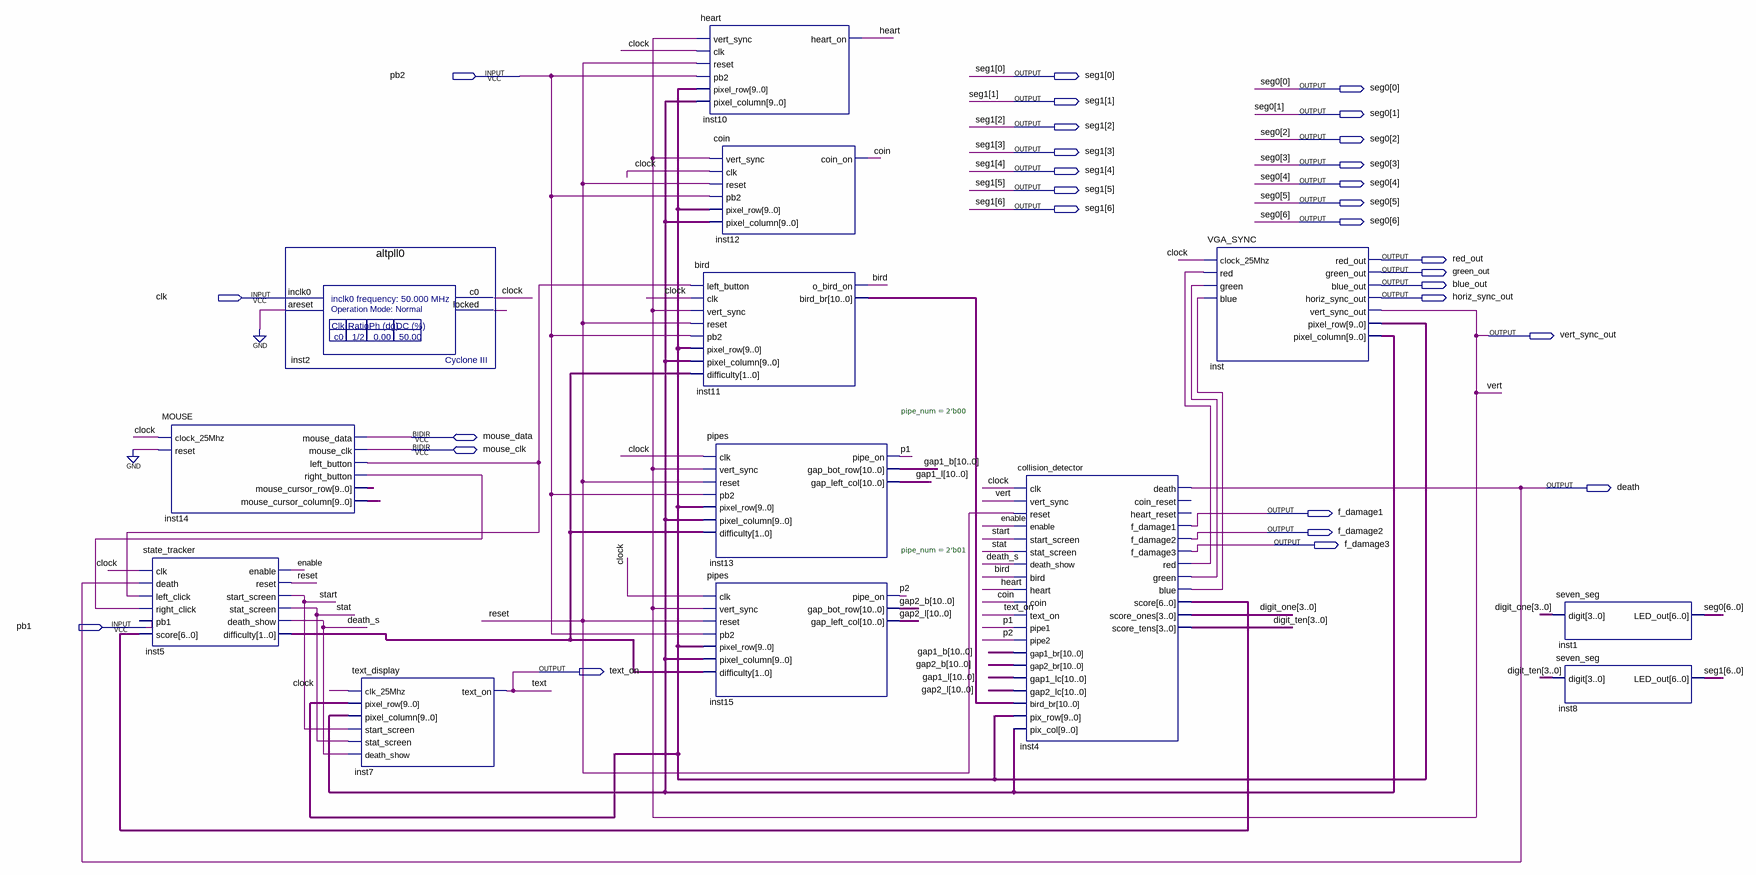
[diagram p0: schematic sheet]
// Quartus schematic GameDesign.bdf as structural Verilog: 13 symbols, 29 pins
module GameDesign (
  input  pb2,
  input  clk,
  input  pb1,
  inout  mouse_data,
  inout  mouse_clk,
  output [6:0] seg1,
  output [6:0] seg0,
  output red_out,
  output green_out,
  output blue_out,
  output horiz_sync_out,
  output vert_sync_out,
  output death,
  output f_damage1,
  output f_damage2,
  output f_damage3,
  output text_on
);

  wire bird, clock, coin, death_s, enable, heart, inst2_locked, inst4_blue, inst4_green, inst4_red,
       inst14_left_button, inst14_right_button, p1, p2, reset, start, stat;
  wire [1:0] inst5_difficulty;
  wire [3:0] digit_one, digit_ten;
  wire [6:0] inst4_score;
  wire [9:0] inst14_mouse_cursor_column, inst14_mouse_cursor_row, inst_pixel_column, inst_pixel_row;
  wire [10:0] gap1_b, gap1_l, gap2_b, gap2_l, inst11_bird_br;

  MOUSE inst14 (
    .clock_25Mhz(clock), .reset(1'b0), .left_button(inst14_left_button), .right_button(inst14_right_button),
    .mouse_cursor_row(inst14_mouse_cursor_row), .mouse_cursor_column(inst14_mouse_cursor_column),
    .mouse_data(mouse_data), .mouse_clk(mouse_clk));
  state_tracker inst5 (
    .clk(clock), .death(death), .left_click(inst14_left_button), .right_click(inst14_right_button),
    .pb1(pb1), .score(inst4_score), .enable(enable), .reset(reset), .start_screen(start), .stat_screen(stat),
    .death_show(death_s), .difficulty(inst5_difficulty));
  altpll0 inst2 (.inclk0(clk), .areset(1'b0), .c0(clock), .locked(inst2_locked));
  text_display inst7 (
    .clk_25Mhz(clock), .pixel_row(inst_pixel_row), .pixel_column(inst_pixel_column), .start_screen(start),
    .stat_screen(stat), .death_show(death_s), .text_on(text_on));
  bird inst11 (
    .left_button(inst14_left_button), .clk(clock), .vert_sync(vert_sync_out), .reset(reset), .pb2(pb2),
    .pixel_row(inst_pixel_row), .pixel_column(inst_pixel_column), .difficulty(inst5_difficulty),
    .o_bird_on(bird), .bird_br(inst11_bird_br));
  heart inst10 (
    .vert_sync(vert_sync_out), .clk(clock), .reset(reset), .pb2(pb2), .pixel_row(inst_pixel_row),
    .pixel_column(inst_pixel_column), .heart_on(heart));
  coin inst12 (
    .vert_sync(vert_sync_out), .clk(clock), .reset(reset), .pb2(pb2), .pixel_row(inst_pixel_row),
    .pixel_column(inst_pixel_column), .coin_on(coin));
  pipes #(.pipe_num(2'b00)) inst13 (
    .clk(clock), .vert_sync(vert_sync_out), .reset(reset), .pb2(pb2), .pixel_row(inst_pixel_row),
    .pixel_column(inst_pixel_column), .difficulty(inst5_difficulty), .pipe_on(p1), .gap_bot_row(gap1_b),
    .gap_left_col(gap1_l));
  pipes #(.pipe_num(2'b01)) inst15 (
    .clk(clock), .vert_sync(vert_sync_out), .reset(reset), .pb2(pb2), .pixel_row(inst_pixel_row),
    .pixel_column(inst_pixel_column), .difficulty(inst5_difficulty), .pipe_on(p2), .gap_bot_row(gap2_b),
    .gap_left_col(gap2_l));
  collision_detector inst4 (
    .clk(clock), .vert_sync(vert_sync_out), .reset(reset), .enable(enable), .start_screen(start),
    .stat_screen(stat), .death_show(death_s), .bird(bird), .heart(heart), .coin(coin), .text_on(text_on),
    .pipe1(p1), .pipe2(p2), .gap1_br(gap1_b), .gap2_br(gap2_b), .gap1_lc(gap1_l), .gap2_lc(gap2_l),
    .bird_br(inst11_bird_br), .pix_row(inst_pixel_row), .pix_col(inst_pixel_column), .death(death),
    .f_damage1(f_damage1), .f_damage2(f_damage2), .f_damage3(f_damage3), .red(inst4_red),
    .green(inst4_green), .blue(inst4_blue), .score(inst4_score), .score_ones(digit_one),
    .score_tens(digit_ten));  // open: coin_reset, heart_reset
  VGA_SYNC inst (
    .clock_25Mhz(clock), .red(inst4_red), .green(inst4_green), .blue(inst4_blue), .red_out(red_out),
    .green_out(green_out), .blue_out(blue_out), .horiz_sync_out(horiz_sync_out),
    .vert_sync_out(vert_sync_out), .pixel_row(inst_pixel_row), .pixel_column(inst_pixel_column));
  seven_seg inst1 (.digit(digit_one), .LED_out(seg0));
  seven_seg inst8 (.digit(digit_ten), .LED_out(seg1));

  // Other names for the same wires on the sheet: text = text_on; vert = vert_sync_out
endmodule
